# EAGLE schematic plugV6-Relay-NC_5x5cm_SMD0805-2 (EAGLE 7.5.0)
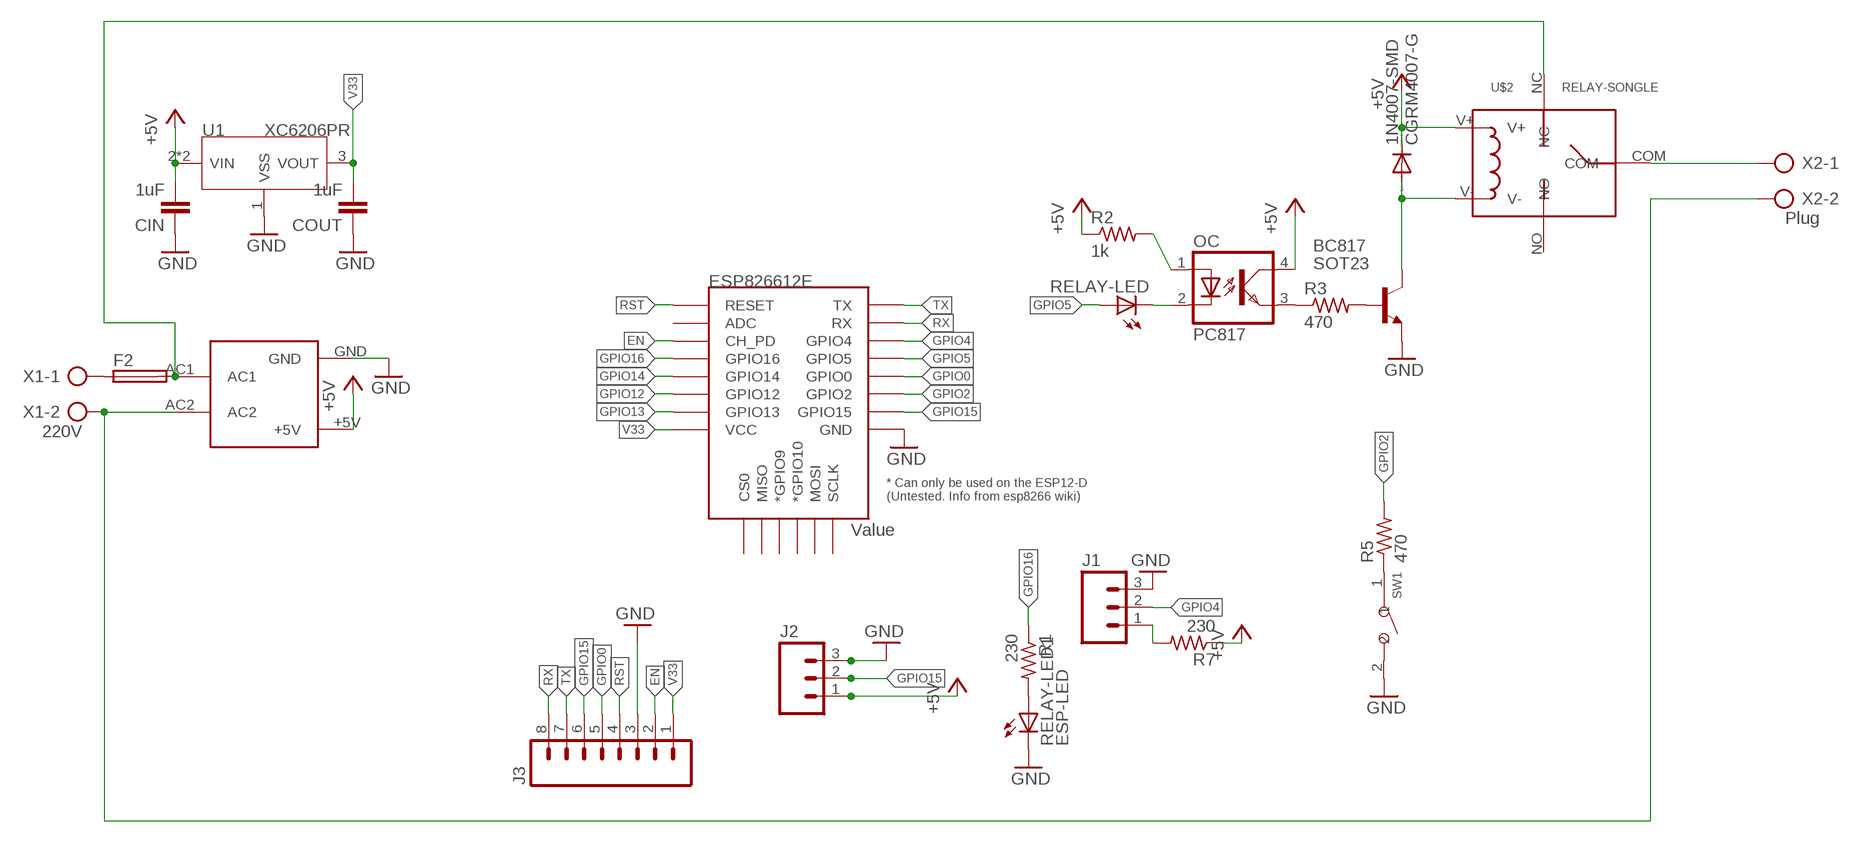
[diagram p0: schematic, sheet 1]

## Parts
1N4007-SMD  CGRM4007-G  [SOD-123_MINI-SMA]
BC817  SOT23  BC817-NPN-SOT23-BEC  [SOT23-BEC]
CIN  1uF  C-EUC0805  [C0805]
COUT  1uF  C-EUC0805  [C0805]
ESP826612E  Value  ESP12ESMD  [ESP12E-SMD]
F2  TR5  [TR5]
J1  M03PTH  [1X03]
J2  M03PTH  [1X03]
J3  M08  [1X08_ROUND]
OC  PC817  [DIL04]
R1  230  R-US_M0805  [M0805]
R2  1k  R-US_M0805  [M0805]
R3  470  R-US_M0805  [M0805]
R5  470  R-US_M0805  [M0805]
R7  230  R-US_M0805  [M0805]
RELAY-LED  LEDCHIPLED_0805  [CHIPLED_0805]
RELAY-LED1  ESP-LED  LEDCHIPLED_0805  [CHIPLED_0805]
SW1  DIP-BUTTON(2P-6.0X3.0X4.3MM)-TS-1101F  [SW2-5.0-6.0X3.0X4.3MM]
U1  XC6206PR  [SOT89]
U$1  HLK-PM01  [HLK-PM01]
U$2  RELAY-SONGLE  [RELAY-SONGLE]
X1  220V  AK300/2  [AK300/2]
X2  Plug  AK300/2  [AK300/2]

## Nets
+5V: 1N4007-SMD.C CIN.2 J2.1 OC.4(COL) R2.1 R7.1 U1.2(VIN) U1.4(VIN) U$1.+5V U$2.V+
EN: ESP826612E.CH_PD J3.2
GND: BC817.E CIN.1 COUT.1 ESP826612E.GND J1.3 J2.3 J3.3 RELAY-LED1.C SW1.2 U1.1(VSS) U$1.GND
GPIO0: ESP826612E.GPIO0 J3.5
GPIO2: ESP826612E.GPIO2 R5.2
GPIO4: ESP826612E.GPIO4 J1.2
GPIO5: ESP826612E.GPIO5 RELAY-LED.A
GPIO12: ESP826612E.GPIO12
GPIO13: ESP826612E.GPIO13
GPIO14: ESP826612E.GPIO14
GPIO15: ESP826612E.GPIO15 J2.2 J3.6
GPIO16: ESP826612E.GPIO16 R1.1
N$1: F2.2 U$1.AC1 U$2.NC
N$2: OC.3(EMIT) R3.1
N$3: U$1.AC2 X1.2 X2.2
N$4: U$2.COM X2.1
N$5: BC817.B R3.2
N$6: OC.2(C) RELAY-LED.C
N$7: R5.1 SW1.1
N$8: R1.2 RELAY-LED1.A
N$9: J1.1 R7.2
N$10: F2.1 X1.1
N$13: OC.1(A) R2.2
N$18: 1N4007-SMD.A BC817.C U$2.V-
RST: ESP826612E.RESET J3.4
RX: ESP826612E.RXD0(RX) J3.8
TX: ESP826612E.TXD0(TX) J3.7
V33: COUT.2 ESP826612E.VCC J3.1 U1.3(VOUT)
Unconnected: ESP826612E.ADC ESP826612E.CS0 ESP826612E.GPIO9(*GPIO9) ESP826612E.GPIO10(*GPIO10) ESP826612E.MISO ESP826612E.MOSI ESP826612E.SCLK U$2.NO

## Library data of the parts
1N4007-SMD = diode:CGRM400*-G: Molded plasitc,JEDEC SOD-123/Mini SMA Source: Comchip CGRM4001-G.pdf
BC817 = transistor-neu-to92:*-NPN-: NPN Transistror
CIN COUT = rcl:C-EU: CAPACITOR, European symbol
ESP826612E = esp8266modules:ESP12E: ESP12E Module
F2 = fuse:TR5: FUSE Wickmann; OC_FARNELL: unknown; OC_NEWARK: unknown
J1 J2 = SparkFun-Connectors:M03: Header 3 Standard 3-pin 0.1" header. Use with straight break away headers (SKU : PRT-00116), right angle break away headers (PRT-00553), swiss pins (PRT-00743), machine pins (PRT-00117), and female headers (PRT-00115). Molex polarized connector foot print use with SKU : PRT-08232 with associated crimp pins and housings.
J3 = SparkFun-Connectors:M08: Header 8 Standard 8-pin 0.1" header. Use with straight break away headers (SKU : PRT-00116), right angle break away headers (PRT-00553), swiss pins (PRT-00743), machine pins (PRT-00117), and female headers (PRT-00115).; PROD_ID: CONN-08437
OC = optocoupler:PC817: SHARP OPTO COUPLER; MPN: PC817X4J000F; OC_FARNELL: 9707727; OC_NEWARK: 97K7059
R1-R3 R5 R7 = rcl:R-US_: RESISTOR, American symbol
RELAY-LED RELAY-LED1 = led:LED: LED OSRAM: - CHIPLED LG R971, LG N971, LY N971, LG Q971, LY Q971, LO R971, LY R971 LH N974, LH R974 LS Q976, LO Q976, LY Q976 LO Q996 - Hyper CHIPLED LW Q18S LB Q993, LB Q99A, LB R99A - SideLED LS A670, LO A670, LY A670, LG A670, LP A670 LB A673, LV A673, LT A673, LW A673 LH A674 LY A675 LS A676, LA A676, LO A676, LY A676, LW A676 LS A679, LY A679, LG A679 - Hyper Micro SIDELED® LS Y876, LA Y876, LO Y876, LY Y876 LT Y87S - SmartLED LW L88C, LW L88S LB L89C, LB L89S, LG L890 LS L89K, LO L89K, LY L89K LS L896, LA L896, LO L896, LY L896 - TOPLED LS T670, LO T670, LY T670, LG T670, LP T670 LSG T670, LSP T670, LSY T670, LOP T670, LYG T670 LG T671, LOG T671, LSG T671 LB T673, LV T673, LT T673, LW T673 LH T674 LS T676, LA T676, LO T676, LY T676, LB T676, LH T676, LSB T676, LW T676 LB T67C, LV T67C, LT T67C, LS T67K, LO T67K, LY T67K, LW E67C LS E67B, LA E67B, LO E67B, LY E67B, LB E67C, LV E67C, LT E67C LW T67C LS T679, LY T679, LG T679 LS T770, LO T770, LY T770, LG T770, LP T770 LB T773, LV T773, LT T773, LW T773 LH T774 LS E675, LA E675, LY E675, LS T675 LS T776, LA T776, LO T776, LY T776, LB T776 LHGB T686 LT T68C, LB T68C - Hyper Mini TOPLED® LB M676 - Mini TOPLED Santana® LG M470 LS M47K, LO M47K, LY M47K Source: http://www.osram.convergy.de LUXEON: - LUMILED® LXK2-PW12-R00, LXK2-PW12-S00, LXK2-PW14-U00, LXK2-PW14-V00 LXK2-PM12-R00, LXK2-PM12-S00, LXK2-PM14-U00 LXK2-PE12-Q00, LXK2-PE12-R00, LXK2-PE12-S00, LXK2-PE14-T00, LXK2-PE14-U00 LXK2-PB12-K00, LXK2-PB12-L00, LXK2-PB12-M00, LXK2-PB14-N00, LXK2-PB14-P00, LXK2-PB14-Q00 LXK2-PR12-L00, LXK2-PR12-M00, LXK2-PR14-Q00, LXK2-PR14-R00 LXK2-PD12-Q00, LXK2-PD12-R00, LXK2-PD12-S00 LXK2-PH12-R00, LXK2-PH12-S00 LXK2-PL12-P00, LXK2-PL12-Q00, LXK2-PL12-R00 Source: www.luxeon.com KINGBRIGHT: KA-3528ASYC Source: www.kingbright.com
SW1 = Seeed-OPL-Switch:DIP-BUTTON(2P-6.0X3.0X4.3MM): 311020025
U1 = IC:XC6206: LOW ESR Cap.Compatible Positive Voltage Regulators
U$1 = HLK-PM01:HLK-PM01
U$2 = Seeed-OPL-Relay:RELAY-SONGLE
X1 X2 = con-ptr500:AK300/2: CONNECTOR; OC_FARNELL: unknown; OC_NEWARK: unknown